# Altium schematic sheet 3.3V_REG_1mA.SchDoc
size A4
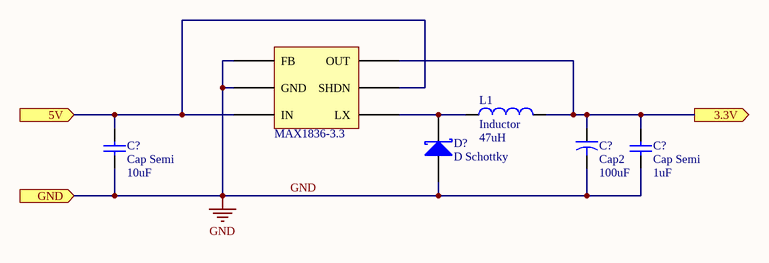
[diagram p0: 3.3V_REG_1mA.SchDoc]

## Parts
(Parts that share a designator on the sheet are numbered #1, #2 ... from top to bottom, then left to right.)
C?#1  Cap2  value 100uF  [CAPR5-4X5]
C?#2  Cap Semi  value 10uF  [C2512]
C?#3  Cap Semi  value 1uF  [C1206]
D?  D Schottky  [SMB]
L1  Inductor  value 47uH  [0402-A]
MAX1836-3.3  MAX1836-3.3V  [SOT23-MAX1836]  (value not drawn)

## Ports
3.3V (out), 5V (in), GND (in)

## Nets
GND: C?#1.2 C?#2.1 C?#3.1 D?.1(A) MAX1836-3.3.FB MAX1836-3.3.GND ; port GND
3.3V: C?#1.1 C?#3.2 L1.2 MAX1836-3.3.OUT ; port 3.3V
5V: C?#2.2 MAX1836-3.3.IN MAX1836-3.3.SHDN ; port 5V
NetD?_2: D?.2(K) L1.1 MAX1836-3.3.LX

## Library data of the parts
C?#1 = Cap2: Capacitor; Published: 23-Sep-2002; PackageReference: CAPR5-4X5; Publisher: Altium Limited; PackageDescription: Capacitor; 2 Leads
C?#2 C?#3 = Cap Semi: Capacitor (Semiconductor SIM Model); Published: 8-Jun-2000; LatestRevisionDate: 29-May-2009; LatestRevisionNote: IPC-7351 Footprint Added.; PackageReference: C1206; Publisher: Altium Limited; PackageDescription: Chip Capacitor
D? = D Schottky: Schottky Diode; Published: 8-Jun-2000; LatestRevisionDate: 17-Jul-2002; LatestRevisionNote: Re-released for DXP Platform.; PackageReference: SMB; Publisher: Altium Limited; PackageDescription: DO-214-AA/SMB; 2 C-Bend Leads; Body 5.3 x 3.6 mm, inc. leads (LxW); Code_JEDEC: DO-214-AA
L1 = Inductor: Code_IEC: 1005; Published: 8-Jun-2000; LatestRevisionDate: 29-May-2009; LatestRevisionNote: IPC-7351 Footprint Added.; PackageReference: 0402-A; Publisher: Altium Limited; PackageDescription: Chip Inductor; Code_JEITA: 0402
MAX1836-3.3 = MAX1836-3.3V: 3.3V Fixed voltage regulator (125mA); HelpURL: http://www.mouser.com/ds/2/256/MAX1836-MAX1837-257737.pdf